# Altium schematic sheet Sheet1.SchDoc
size A4; SheetNumber: 1; SheetTotal: 1; SPICEModelCacheWFDLOHPZ: <root> / <DocumentId>WFDLOHPZ</DocumentId> / <CacheFrame Number="0"> / <Model Name="6033_7447785006_6.8u" Kind="CKT"> / <Text>******* / .subckt 6033_7447785006_6.8u 1 2 / Rp 1 2 8506.21069778 / Cp 1 2 2.12954534656p / Rs 1 N3 0.079 / L1 N3 2 6.05071959927u / .ends 6033_7447785006_6.8u</Text> / </Model> / <Model Name="1808_8853620100181_220pf" Kind="CKT"> / <Text>******* / .subckt 1808_8853620100181_220pF 1 2 / Rser 1 3 0.0587493769172 / Lser 2 4 0.00000000095 / C1 3 4 0.00000000022 / Rpar 3 4 100000000000 / .ends 1808_8853620100181_220pF</Text> / </Model> / <Model Name="0805_150080rs75000" Kind="CKT"> / <Text>****** / .subckt 0805_150080RS75000  1  2 / D1 1 2 SMCW / .MODEL SMCW D / + IS=10.000E-21 / + N=1.6992 / + RS=1.0000E-6 / + IKF=1.2373E-3 / + CJO=1.0000E-12 / + M=.3333 / + VJ=.75 / + BV=5 / + IBV=10.00E-6 / + TT=5.0000E-9 / .ends</Text> / </Model> / </CacheFrame> / </root>
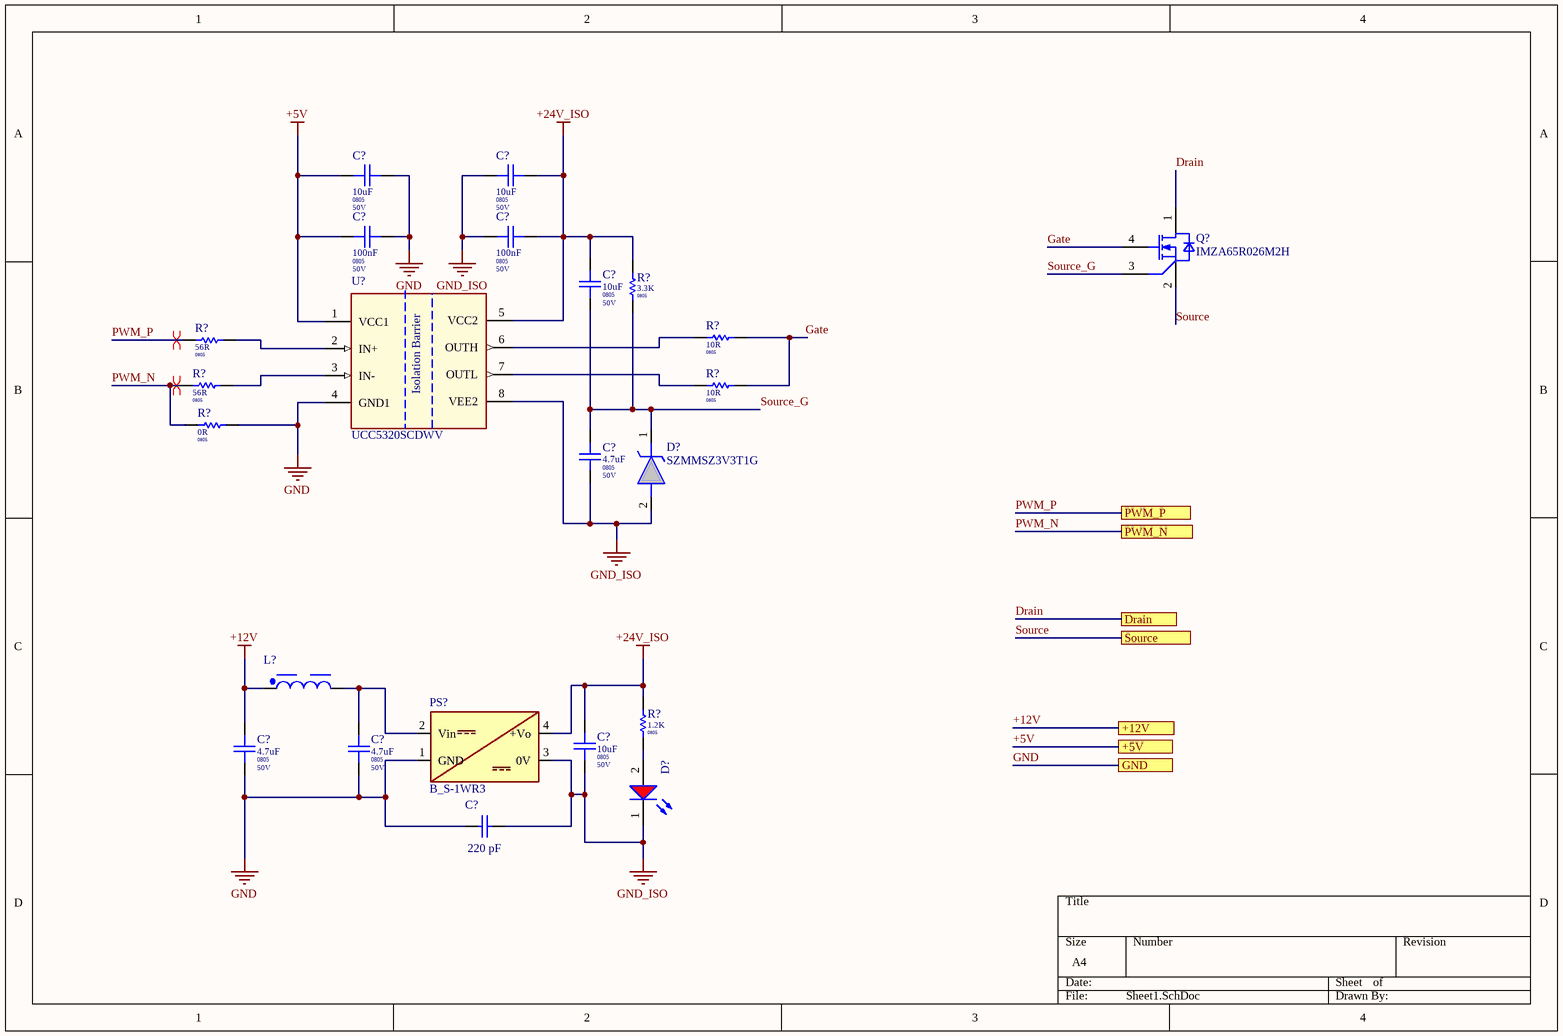
[diagram p0: Sheet1.SchDoc]

## Parts
(Parts that share a designator on the sheet are numbered #1, #2 ... from top to bottom, then left to right.)
C?#1  Package / Case: 0805  Voltage: 50V  [CAPC 0805]  (hidden comment: 10uF)
C?#2  Package / Case: 0805  Voltage: 50V  [CAPC 0805]  (hidden comment: 10uF)
C?#3  Package / Case: 0805  Voltage: 50V  [CAPC 0805]  (hidden comment: 100nF)
C?#4  Package / Case: 0805  Voltage: 50V  [CAPC 0805]  (hidden comment: 100nF)
C?#5  Package / Case: 0805  Voltage: 50V  [CAPC 0805]  (hidden comment: 10uF)
C?#6  Package / Case: 0805  Voltage: 50V  [CAPC 0805]  (hidden comment: 4.7uF)
C?#7  Package / Case: 0805  Voltage: 50V  [CAPC 0805]  (hidden comment: 4.7uF)
C?#8  Package / Case: 0805  Voltage: 50V  [CAPC 0805]  (hidden comment: 4.7uF)
C?#9  Package / Case: 0805  Voltage: 50V  [CAPC 0805]  (hidden comment: 10uF)
C?#10  220 pF  [WCAP-CSSA_1808_8853620100181]
D?#1  SZMMSZ3V3T1G  [SOD3716X135N]
D?#2  Red, 2V, 140°  [WL-SMCW_0805_150080xx75000]  (value not drawn)
L?  6.8μH  [WE-PD_6033R]  (value not drawn)
PS?  B_S-1WR3  [B_S-1WR3]
Q?  IMZA65R026M2H  [INF-PG-TO247-4-3]
R?#1  Package / Case: 0805  [RESC 0805]  (hidden comment: 3.3K)
R?#2  Package / Case: 0805  [RESC 0805]  (hidden comment: 10R)
R?#3  Package / Case: 0805  [RESC 0805]  (hidden comment: 56R)
R?#4  Package / Case: 0805  [RESC 0805]  (hidden comment: 56R)
R?#5  Package / Case: 0805  [RESC 0805]  (hidden comment: 10R)
R?#6  Package / Case: 0805  [RESC 0805]  (hidden comment: 0R)
R?#7  Package / Case: 0805  [RESC 0805]  (hidden comment: 1.2K)
U?  UCC5320SCDWV  [DWV0008A]

## Ports
+5V, +12V, Drain, GND, PWM_N, PWM_P, Source

## Nets
+5V: C?#1.1 C?#3.1 U?.1(VCC1) ; port +5V
+12V: C?#7.2 L?.1 ; port +12V
+24V_ISO: C?#2.2 C?#4.2 C?#5.2 C?#9.2 PS?.4(+Vo) R?#1.2 R?#7.2 U?.5(VCC2)
GND: C?#1.2 C?#3.2 C?#7.1 C?#8.1 C?#10.1 PS?.1(GND) R?#6.2 U?.4(GND1) ; port GND
GND_ISO: C?#2.1 C?#4.1 C?#6.1 C?#9.1 C?#10.2 D?#1.2(A) D?#2.1(K) PS?.3(0V) U?.8(VEE2)
Drain: Q?.1(DRAIN) ; port Drain
Gate: Q?.4(GATE) R?#2.2 R?#5.2
PWM_N: R?#4.1 R?#6.1 ; port PWM_N
PWM_P: R?#3.1 ; port PWM_P
Source: Q?.2(SOURCE1) ; port Source
Source_G: C?#5.1 C?#6.2 D?#1.1(K) Q?.3(SOURCE2) R?#1.1
NetC?#8_2: C?#8.2 L?.2 PS?.2(Vin)
NetD?#2_2: D?#2.2(A) R?#7.1
NetR?#2_1: R?#2.1 U?.6(OUTH)
NetR?#3_2: R?#3.2 U?.2(IN+)
NetR?#4_2: R?#4.2 U?.3(IN-)
NetR?#5_1: R?#5.1 U?.7(OUTL)

## Layout directives
differential pair: PWM_N, PWM_P

## Notes on the sheet
- (in symbol UCC5320SCDWV) Isolation Barrier

## Library data of the parts
C?#1 C?#2 C?#5 C?#9 = CAPC0588: Capacitor Ceramic 10uF 50V 0805; Tolerance: %10; Value Rating: uF; Value: 10uF; Part Number: CAPC0588; Category: Capacitor Ceramic; Values: 10uF 50V
C?#3 C?#4 = CAPC0572: Capacitor Ceramic 100nF 50V 0805; Tolerance: %10; Value Rating: nF; Favorites: Favorite; Value: 100nF; Part Number: CAPC0572; Category: Capacitor Ceramic; Values: 100nF 50V
C?#6-C?#8 = CAPC0584: Capacitor Ceramic 4.7uF 50V 0805; Tolerance: %10; Value Rating: uF; Value: 4.7uF; Part Number: CAPC0584; Category: Capacitor Ceramic; Values: 4.7uF 50V
C?#10 = 8853620100181: WCAP-CSSA Multilayer Ceramic Chip Safety Capacitor, SMT, size 1808, NP0 Class I, 220 pF, 250 V (AC); Manufacturer: Wurth Elektronik; Case/Size Code: 1808; Capacitance Tolerance: ±5%; Dissipation Factor: 0.1%; Impulse Voltage: 2500 V (DC); Insulation Resistance: 100 GΩ; Safety Class: X2; Manufacturer Part Number: 8853620100181; Category: Multilayer Ceramic Chip Capacitors; Match Code: WCAP-CSSA; ComponentLink1Description: Website Link; ComponentLink1URL: https://www.we-online.com/redexpert/article/8853620100181?ad; ComponentLink2Description: Datasheet Link; ComponentLink2URL: https://www.we-online.com/redexpert/spec/8853620100181?ad; Mount: Surface Mount; Min Operating Temperature: -55 °C; Max Operating Temperature: 125 °C; Packaging: Tape and Reel; Length: 4.5 mm; Width: 2 mm; Height: 2 mm; Capacitance: 220 pF; Ceramic Type: NP0 Class I; Rated Voltage: 250 V (AC)
D?#1 = SZMMSZ3V3T1G: 500 mW Rating on FR-4 or FR-5 Board; Wide Zener Reverse Voltage Range - 2.4 V to 56 V; Package Designed for Optimal Automated Board Assembly; Small Package Size for High Density Applications; ESD Rating of Class 3 (exceeding 16 kV) per the Human Body Model Mechanical Characteristics:; CASE: Void-free, transfer-molded, thermosetting plastic case; FINISH: Corrosion resistant finish, easily solderable; MAXIMUM CASE TEMPERATURE FOR SOLDERING PURPOSES: 260C for 10 Seconds; POLARITY: Cathode indicated by polarit; Manufacturer_Name: onsemi; Geometry.Height: 1.35mm; Mouser Part Number: 863-SZMMSZ3V3T1G; Mouser Price/Stock: https://www.mouser.co.uk/ProductDetail/onsemi/SZMMSZ3V3T1G?qs=PJJcWtbOkNWDWixFbpUCfA%3D%3D; Manufacturer_Part_Number: SZMMSZ3V3T1G; Datasheet Link: https://www.onsemi.com/pub/Collateral/MMSZ2V4T1-D.PDF
D?#2 = 150080RS75000: WL-SMCW Mono-color Chip LED Waterclear, SMT, size 0805, Red, 2V, 140°; Manufacturer: Wurth Elektronik; Case/Size Code: 0805; Chip Technology: AlInGaP; Dominant Wavelength: 625nm; Luminous Intensity: 150mcd; Peak Wavelength: 630nm; Manufacturer Part Number: 150080RS75000; Category: Signal LEDs; Match Code: WL-SMCW; ComponentLink1Description: Website Link; ComponentLink1URL: https://www.we-online.com/redexpert/article/150080RS75000?ad; ComponentLink2Description: Datasheet Link; ComponentLink2URL: https://www.we-online.com/redexpert/spec/150080RS75000?ad; Mount: Surface Mount; Min Operating Temperature: -40°C; Max Operating Temperature: 85°C; Packaging: Tape and Reel; Length: 2mm; Width: 1.25mm; Height: 0.7mm; Emitting Color: Red; Forward Voltage: 2V; Viewing Angle: 140°
L? = 7447785006: WE-PD SMT Power Inductor, size 6033R, 6.8μH, 2.3A, 100mΩ; Manufacturer: Wurth Elektronik; DC Resistance: 79mΩ; Saturation Current: 2A; Self Resonant Frequency: 45MHz; Type: Robust; Manufacturer Part Number: 7447785006; Category: Power Inductors; Match Code: WE-PD; ComponentLink1Description: Website Link; ComponentLink1URL: https://www.we-online.com/redexpert/article/7447785006?ad; ComponentLink2Description: Datasheet Link; ComponentLink2URL: https://www.we-online.com/redexpert/spec/7447785006?ad; Mount: Surface Mount; Min Operating Temperature: -40°C; Max Operating Temperature: 125°C; Packaging: Tape and Reel; Case/Size Code: 6033R; Length: 5.9mm; Width: 6.2mm; Height: 3.3mm; DC Resistance Max: 100mΩ; Inductance: 6.8μH; Rated Current: 2.3A
Q? = IMZA65R026M2H: Insulated-Gate Field-Effect Transistor (IGFET), N-Channel, Enhancement, Body Diode, Pin 1 Drain, 2 Power Source,  3 Driver Source, 4 Gate, 4 Pins; Manufacturer: Infineon Technologies; Manufacturer Order Number: IMZA65R026M2H; PackageReference: PG-TO247-4-8
R?#1 = R0354: 3.3K 0805; Part Number: R0354; Tolerance: %5; Power: 1/10W; Value: 3.3K; Category: Resistor; Values: 3.3K
R?#2 R?#5 = R0295: 10R 0805; Part Number: R0295; Tolerance: %5; Power: 1/10W; Value: 10R; Category: Resistor; Values: 10R
R?#3 R?#4 = R0312: 56R 0805; Part Number: R0312; Tolerance: %5; Power: 1/10W; Value: 56R; Category: Resistor; Values: 56R
R?#6 = R0294: 0R 0805; Part Number: R0294; Tolerance: %5; Power: 1/10W; Value: 0R; Category: Resistor; Values: 0R
R?#7 = R0344: 1.2K 0805; Part Number: R0344; Tolerance: %5; Power: 1/10W; Value: 1.2K; Category: Resistor; Values: 1.2K
U? = UCC5320SCDWV: 3k/5kVrms, 2A/2A single-channel isolated gate driver with UVLO referenced to GND or split output 8-SOIC -40 to 125; Manufacturer_Name: Texas Instruments; TYPE: TYPE; RefDes: RefDes; Copyright: Copyright (C) 2025 Ultra Librarian. All rights reserved.; Manufacturer_Part_Number: UCC5320SCDWV; Datasheet: https://www.ti.com/lit/gpn/ucc5320
PS? = B_S-1WR3: Datasheet_Link: https://www.mornsun-power.com/html/pdf/B1224S-1WR3.html; Supply_Link: https://www.motorobit.com/b1224s-1wr3-dc-dc-1w-108-132v-giris-24v-cikis-voltaj-donusturucu